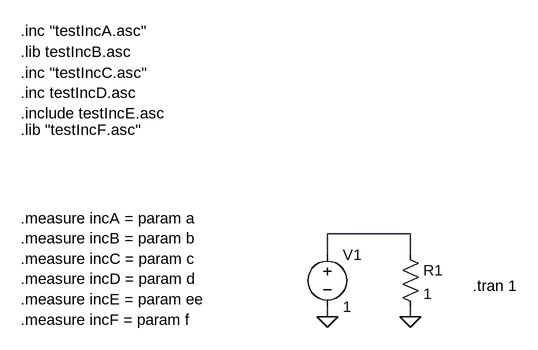
[diagram p0: schematic testInc1.asc]
testInc1.asc, the LTspice schematic file:
Version 4
SHEET 1 880 680
WIRE -16 240 -144 240
WIRE -144 272 -144 240
WIRE -16 272 -16 240
WIRE -144 368 -144 352
WIRE -16 368 -16 352
FLAG -144 368 0
FLAG -16 368 0
SYMBOL voltage -144 256 R0
SYMATTR InstName V1
SYMATTR Value 1
SYMBOL res -32 256 R0
SYMATTR InstName R1
SYMATTR Value 1
TEXT -616 -72 Left 2 !.inc "testIncA.asc"
TEXT -616 -40 Left 2 !.lib testIncB.asc
TEXT -616 -8 Left 2 !.inc "testIncC.asc"\n.inc testIncD.asc\n.include testIncE.asc
TEXT 80 320 Left 2 !.tran 1
TEXT -616 80 Left 2 !.lib "testIncF.asc"
TEXT -616 216 Left 2 !.measure incA = param a\n.measure incB = param b\n.measure incC = param c\n.measure incD = param d\n.measure incE = param ee\n.measure incF = param f

The netlist it stands for:
* testInc1.asc
V1 N001 0 1
R1 N001 0 1
.inc "testIncA.asc"
.lib testIncB.asc
.inc "testIncC.asc"
.inc testIncD.asc
.include testIncE.asc
.tran 1
.lib "testIncF.asc"
.measure incA = param a
.measure incB = param b
.measure incC = param c
.measure incD = param d
.measure incE = param ee
.measure incF = param f
.backanno
.end